# Altium schematic sheet 数据采集原理图.SchDoc
size A4
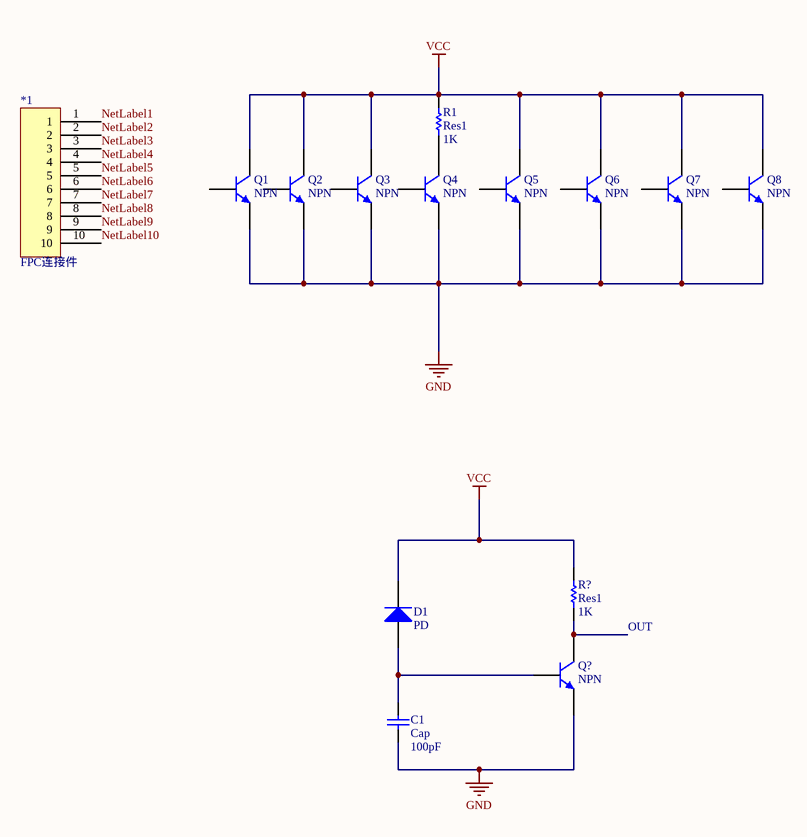
[diagram p0: 数据采集原理图.SchDoc]

## Parts
*1  FPC连接件
C1  Cap  value 100pF  [RAD-0.3]
D1  PD  [SMC]
Q1  NPN  [TO-226-AA]
Q2  NPN  [TO-226-AA]
Q3  NPN  [TO-226-AA]
Q4  NPN  [TO-226-AA]
Q5  NPN  [TO-226-AA]
Q6  NPN  [TO-226-AA]
Q7  NPN  [TO-226-AA]
Q8  NPN  [TO-226-AA]
Q?  NPN  [TO-226-AA]
R1  Res1  value 1K  [AXIAL-0.3]
R?  Res1  value 1K  [AXIAL-0.3]

## Nets
GND: C1.1 Q1.3(E) Q2.3(E) Q3.3(E) Q4.3(E) Q5.3(E) Q6.3(E) Q7.3(E) Q8.3(E) Q?.3(E)
VCC: D1.2(K) Q1.1(C) Q2.1(C) Q3.1(C) Q5.1(C) Q6.1(C) Q7.1(C) Q8.1(C) R1.2 R?.2
NetLabel1: *1.1
NetLabel2: *1.2
NetLabel3: *1.3
NetLabel4: *1.4
NetLabel5: *1.5
NetLabel6: *1.6
NetLabel7: *1.7
NetLabel8: *1.8
NetLabel9: *1.9
NetLabel10: *1.10
NetC1_2: C1.2 D1.1(A) Q?.2(B)
NetQ4_1: Q4.1(C) R1.1
NetQ?_1: Q?.1(C) R?.1

Not connected (* = marked no-connect by the designer): Q1 2(B); Q2 2(B); Q3 2(B); Q4 2(B); Q5 2(B); Q6 2(B); Q7 2(B); Q8 2(B)

## Notes on the sheet
- OUT

## Library data of the parts
C1 = Cap: Capacitor; Published: 8-Jun-2000; LatestRevisionDate: 17-Jul-2002; LatestRevisionNote: Re-released for DXP Platform.; PackageReference: RAD-0.3; Publisher: Altium Limited; PackageDescription: Radial Cap, Thru-Hole; 2 Leads; 0.3 in Pin Spacing
D1 = Diode: Default Diode; Published: 8-Jun-2000; LatestRevisionDate: 17-Jul-2002; LatestRevisionNote: Re-released for DXP Platform.; PackageVersion: Sep-1996; PackageReference: SMC; Publisher: Altium Limited; PackageDescription: DO-214-AB/SMC; 2 C-Bend Leads; Body 7.9 x 5.9 mm, inc. leads (LxW); Code_JEDEC: DO-214-AB
Q1-Q8 Q? = NPN: NPN Bipolar Transistor; Published: 8-Jun-2000; LatestRevisionDate: 17-Jul-2002; LatestRevisionNote: Re-released for DXP Platform.; PackageReference: TO-226-AA; Publisher: Altium Limited; PackageDescription: TO, Flat Index; 3 In-Line, Axial Leads; Body Dia. 4.8mm; Leads 0.55 x 0.51 mm (max); Code_JEDEC: TO-226-AA
R1 R? = Res1: Resistor; Published: 8-Jun-2000; LatestRevisionDate: 17-Jul-2002; LatestRevisionNote: Re-released for DXP Platform.; PackageReference: AXIAL-0.3; Publisher: Altium Limited; PackageDescription: Axial Device, Thru-Hole; 2 Leads; 0.3 in Pin Spacing